# Altium schematic sheet Sheet2.SchDoc
size A4
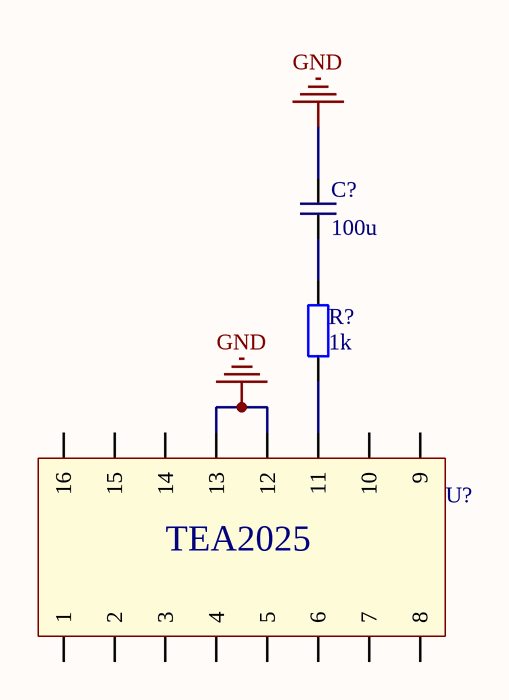
[diagram p0: Sheet2.SchDoc]

## Parts
C?  100u  [RAD0.1]
R?  1k  [AXIAL-0.3]
U?  TEA2025  [DIP16]  (value not drawn)

## Nets
GND: C?.2 U?.12 U?.13
NetC?_1: C?.1 R?.2
NetR?_1: R?.1 U?.11

Not connected (* = marked no-connect by the designer): U? 1 2 3 4 5 6 7 8 9 10 14 15 16

## Library data of the parts
C? = Cap
R? = Res: Resistor; Published: 8-Jun-2000; LatestRevisionDate: 17-Jul-2002; LatestRevisionNote: Re-released for DXP Platform.; PackageReference: AXIAL-0.4; Publisher: Altium Limited; Value: 1K